# EAGLE design try1 (EAGLE 6.4)
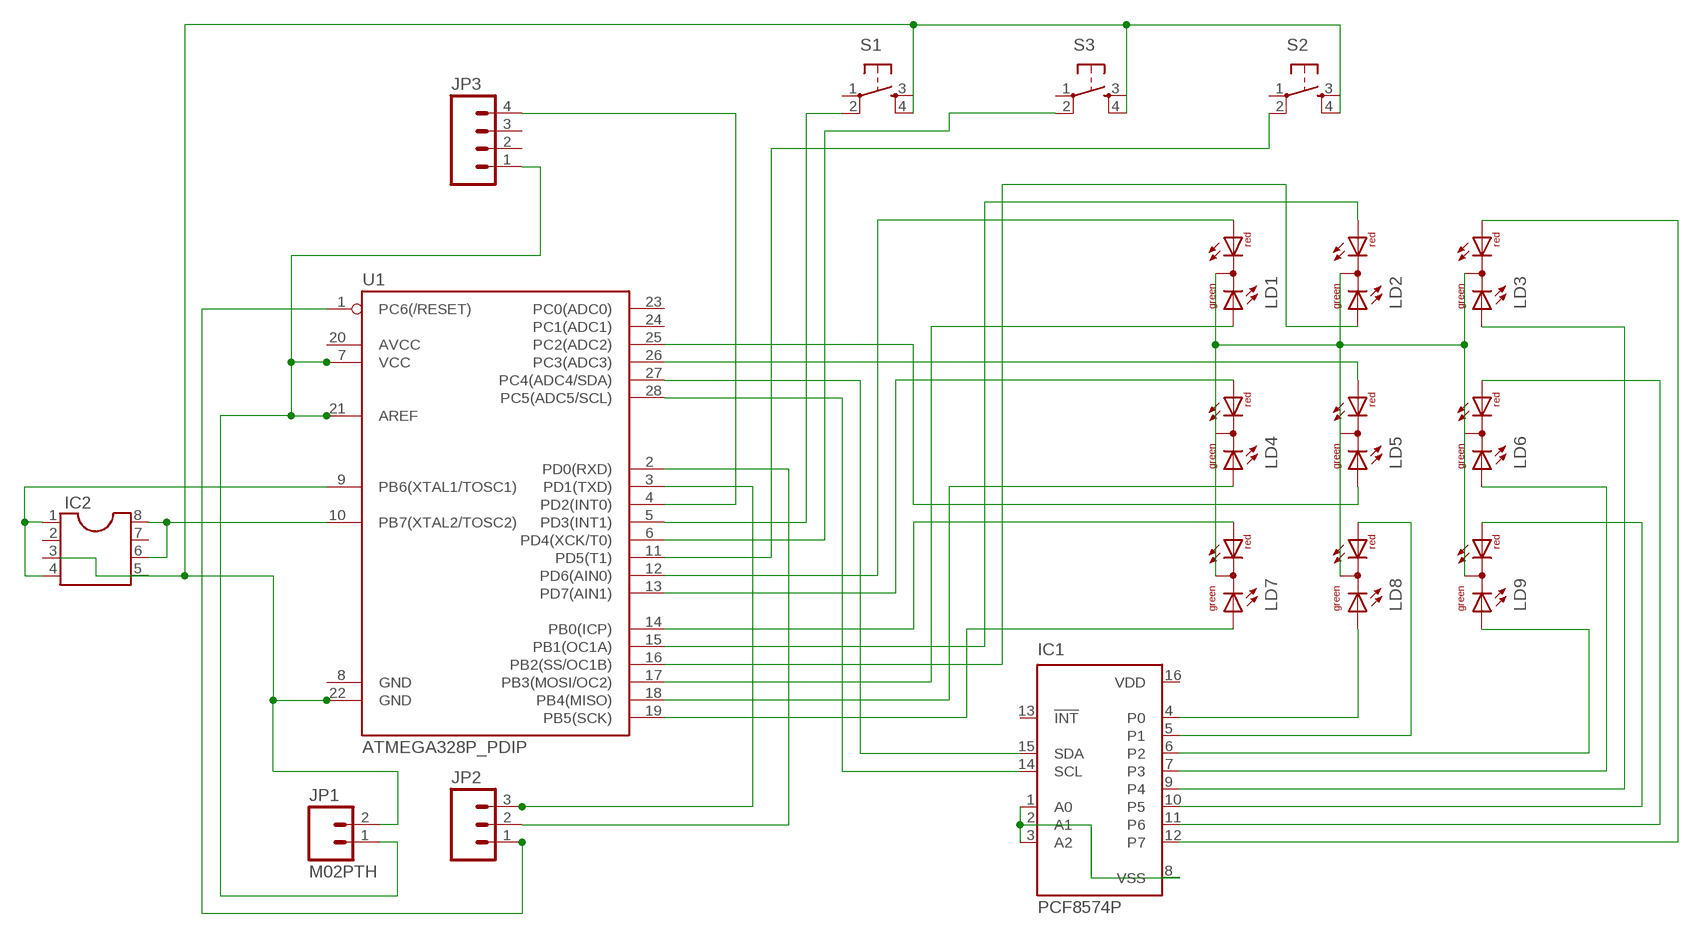
[diagram p0: schematic, sheet 1]

## Parts
IC1  PCF8574P  [DIL16]
IC2  DIL8S  [SOCKET-08]
JP1  M02PTH  [1X02]
JP2  M03PTH  [1X03]
JP3  M04PTH  [1X04]
LD1  DUOLED-RG-C  [DUOLED-C-5MM]
LD2  DUOLED-RG-C  [DUOLED-C-5MM]
LD3  DUOLED-RG-C  [DUOLED-C-5MM]
LD4  DUOLED-RG-C  [DUOLED-C-5MM]
LD5  DUOLED-RG-C  [DUOLED-C-5MM]
LD6  DUOLED-RG-C  [DUOLED-C-5MM]
LD7  DUOLED-RG-C  [DUOLED-C-5MM]
LD8  DUOLED-RG-C  [DUOLED-C-5MM]
LD9  DUOLED-RG-C  [DUOLED-C-5MM]
S1  TAC_SWITCHPTH  [TACTILE-PTH]
S2  TAC_SWITCHPTH  [TACTILE-PTH]
S3  TAC_SWITCHPTH  [TACTILE-PTH]
U1  ATMEGA328P_PDIP  [DIL28-3]

## Nets
GND: JP1.2 S1.4 S2.4 S3.4 U1.22(GND)
N$1: IC2.1 IC2.4 U1.9(PB6(XTAL1/TOSC1))
N$2: JP2.1 U1.1(PC6(/RESET))
N$3: LD1.AR U1.12(PD6(AIN0))
N$4: JP2.3 U1.3(PD1(TXD))
N$5: JP2.2 U1.2(PD0(RXD))
N$6: LD4.AR U1.13(PD7(AIN1))
N$7: IC1.1(A0) IC1.2(A1) IC1.3(A2) IC1.8(VSS)
N$8: IC1.15(SDA) U1.27(PC4(ADC4/SDA))
N$9: IC1.14(SCL) U1.28(PC5(ADC5/SCL))
N$10: S1.2 U1.5(PD3(INT1))
N$11: JP3.4 U1.4(PD2(INT0))
N$12: IC2.6 IC2.8 U1.10(PB7(XTAL2/TOSC2))
N$13: S3.2 U1.6(PD4(XCK/T0))
N$14: S2.2 U1.11(PD5(T1))
N$15: LD7.AR U1.14(PB0(ICP))
N$16: LD1.AX(AG) U1.17(PB3(MOSI/OC2))
N$17: LD4.AX(AG) U1.18(PB4(MISO))
N$18: LD7.AX(AG) U1.19(PB5(SCK))
N$19: LD2.AR U1.15(PB1(OC1A))
N$20: LD2.AX(AG) U1.16(PB2(SS/OC1B))
N$21: IC1.12(P7) LD3.AR
N$22: IC1.11(P6) LD6.AR
N$23: IC1.10(P5) LD9.AR
N$24: IC1.9(P4) LD3.AX(AG)
N$25: IC1.7(P3) LD6.AX(AG)
N$26: IC1.6(P2) LD9.AX(AG)
N$27: IC1.4(P0) LD8.AX(AG)
N$28: IC1.5(P1) LD8.AR
N$29: LD5.AR U1.26(PC3(ADC3))
N$30: LD5.AX(AG) U1.25(PC2(ADC2))
VCC: JP1.1 JP3.1 LD1.C LD2.C LD3.C LD7.C LD8.C LD9.C U1.7(VCC) U1.21(AREF)
Unconnected: IC1.13(!INT) IC2.2 IC2.3 IC2.5 IC2.7 JP3.2 JP3.3 LD4.C LD5.C LD6.C S1.1 S1.3 S2.1 S2.3 S3.1 S3.3 U1.8(GND) U1.20(AVCC) U1.23(PC0(ADC0)) U1.24(PC1(ADC1))

## Power pins joined to a net without a drawn wire
VDD: IC1.16(VDD)

## Library data of the parts
IC1 = micro-philips:PCF8574: I2C-Bus Remote 8-bit I/O expander http://www.semiconductors.philips.com/acrobat_download/datasheets/PCF8574_4.pdf; MPN: PCF8574PN; OC_FARNELL: 204020; OC_NEWARK: 11N8515
IC2 = ic-package:DIL8: Dual In Line / Socket
JP1 = SparkFun-Connectors:M02: Standard 2-pin 0.1" header. Use with - straight break away headers ( PRT-00116) - right angle break away headers (PRT-00553) - swiss pins (PRT-00743) - machine pins (PRT-00117) - female headers (PRT-00115) Molex polarized connector foot print use with: PRT-08233 with associated crimp pins and housings. 2.54_SCREWTERM for use with PRT-10571. 3.5mm Screw Terminal footprints for PRT-08084 5mm Screw Terminal footprints for use with PRT-08433
JP2 = SparkFun-Connectors:M03: Header 3 Standard 3-pin 0.1" header. Use with straight break away headers (SKU : PRT-00116), right angle break away headers (PRT-00553), swiss pins (PRT-00743), machine pins (PRT-00117), and female headers (PRT-00115). Molex polarized connector foot print use with SKU : PRT-08232 with associated crimp pins and housings.
JP3 = SparkFun-Connectors:M04: Header 4 Standard 4-pin 0.1" header. Use with straight break away headers (SKU : PRT-00116), right angle break away headers (PRT-00553), swiss pins (PRT-00743), machine pins (PRT-00117), and female headers (PRT-00115). Molex polarized connector foot print use with SKU : PRT-08231 with associated crimp pins and housings. 1MM SMD Version SKU: PRT-10208
LD1-LD9 = led:DUOLED-RG-C: DUO LED 2 colors (red/green), 5 mm, round, common Cathode www.ligitek.com or other producers.
S1-S3 = SparkFun-Electromechanical:TAC_SWITCH: Momentary Switch Button commonly used for reset or general input. Spark Fun Electronics SKU : COM-00097 SMT- SWCH-08247
U1 = SparkFun-DigitalIC:ATMEGA328P_PDIP: uC used in the Arduino 32kb flash, 1k EEPROM, 2k SRAM This is the through-hole version of this chip.

## Board
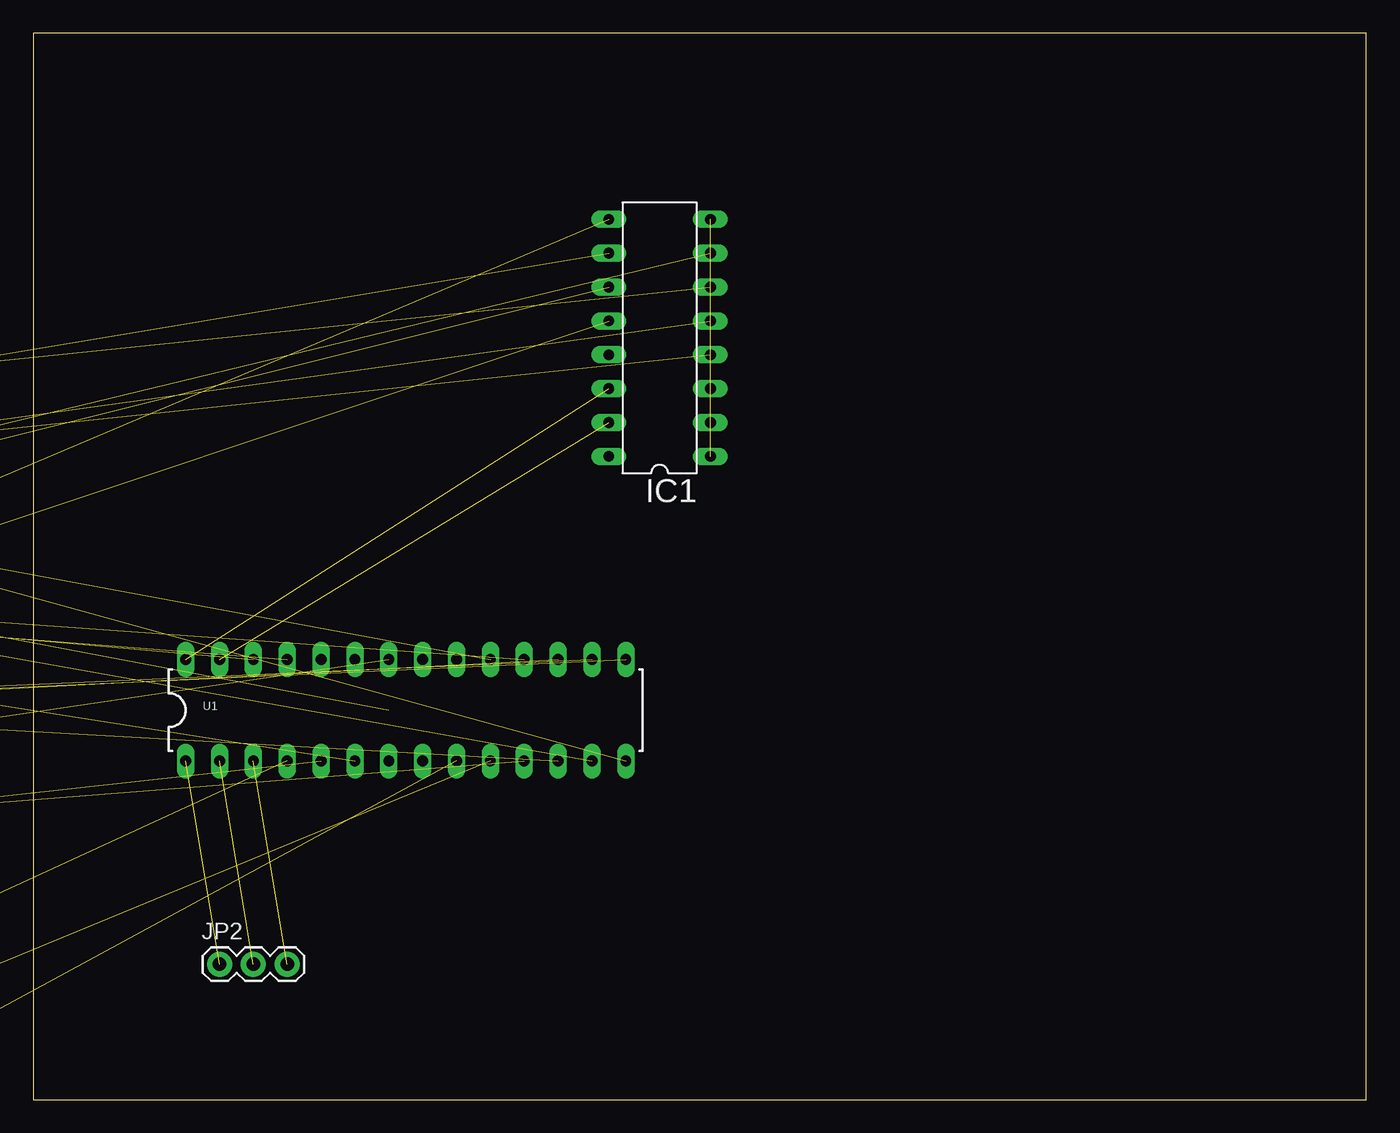
[diagram p1: board, top side]
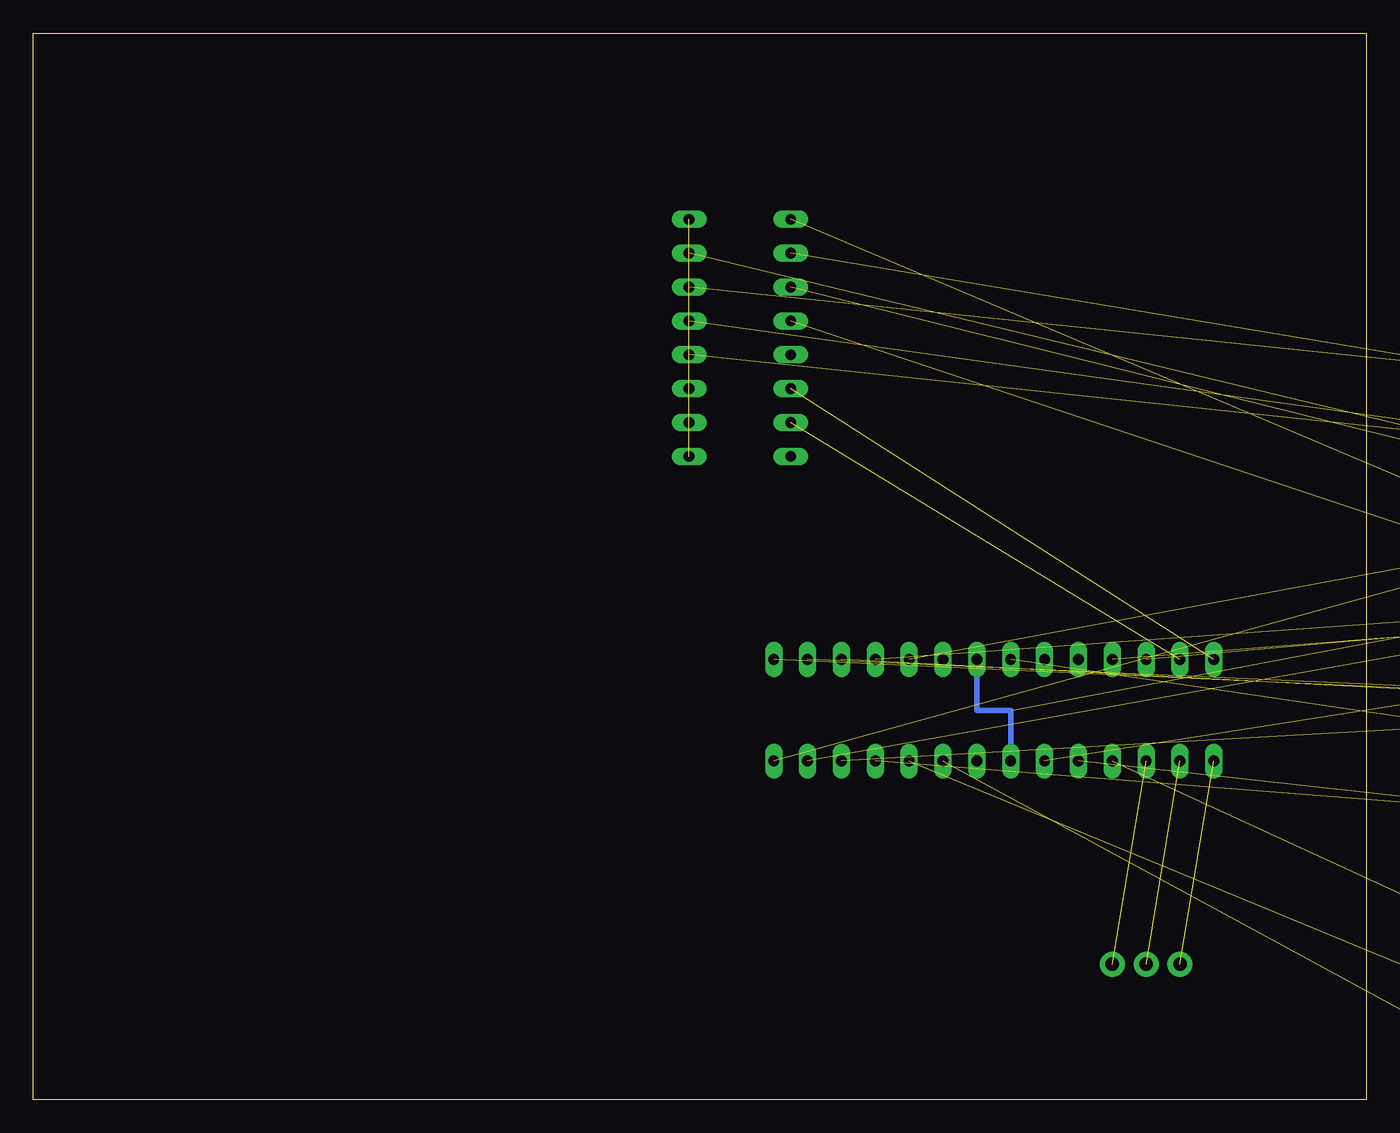
[diagram p2: board, bottom side, seen from below]

Size 100 x 80 mm. Coordinates in mm from the lower left corner, seen from the top.
Outline: 0,0 100,0 100,80 0,80 0,0
Copper layers (1*16): Top 0.035mm / dielectric 1.5mm / Bottom 0.035mm
Design rules "default": minimum track width 10mil, minimum drill 24mil, track to track 8mil, track to pad 8mil, pad to pad 8mil, via to via 8mil, smd to smd 8mil, copper to edge 40mil, drill to drill 8mil, minimum pad ring 10mil, minimum via ring 8mil, stop-mask expansion 4mil, vias tented up to drill 0mil, thermal gap 10mil

### Footprints (pad centres in the part's own frame; a part is rotated, then mirrored left to right if it is on the bottom)
DIL16 = drill 0.813 long: 1 -8.89,-3.81; 2 -6.35,-3.81; 3 -3.81,-3.81; 4 -1.27,-3.81; 5 1.27,-3.81; 6 3.81,-3.81; 7 6.35,-3.81; 8 8.89,-3.81; 9 8.89,3.81; 10 6.35,3.81; 11 3.81,3.81; 12 1.27,3.81; 13 -1.27,3.81; 14 -3.81,3.81; 15 -6.35,3.81; 16 -8.89,3.81
SOCKET-08 = drill 0.813 long: 1 -3.81,-3.81; 2 -1.27,-3.81; 3 1.27,-3.81; 4 3.81,-3.81; 5 3.81,3.81; 6 1.27,3.81; 7 -1.27,3.81; 8 -3.81,3.81
1X02 = drill 1.016 pad 1.88: 1 0,0; 2 2.54,0
1X03 = drill 1.016 pad 1.88: 1 0,0; 2 2.54,0; 3 5.08,0
1X04 = drill 1.016 pad 1.88 square: 1 0,0 | drill 1.016 pad 1.88: 2 2.54,0; 3 5.08,0; 4 7.62,0
DUOLED-C-5MM = drill 0.813 long: AR 2.54,0; AX -2.54,0; C 0,0
TACTILE-PTH = drill 1.016 pad 1.88: 1 -3.251,2.261; 2 3.251,2.261; 3 -3.251,-2.261; 4 3.251,-2.261
DIL28-3 = drill 0.813 long: 1 -16.51,-3.81; 2 -13.97,-3.81; 3 -11.43,-3.81; 4 -8.89,-3.81; 5 -6.35,-3.81; 6 -3.81,-3.81; 7 -1.27,-3.81; 8 1.27,-3.81; 9 3.81,-3.81; 10 6.35,-3.81; 11 8.89,-3.81; 12 11.43,-3.81; 13 13.97,-3.81; 14 16.51,-3.81; 15 16.51,3.81; 16 13.97,3.81; 17 11.43,3.81; 18 8.89,3.81; 19 6.35,3.81; 20 3.81,3.81; 21 1.27,3.81; 22 -1.27,3.81; 23 -3.81,3.81; 24 -6.35,3.81; 25 -8.89,3.81; 26 -11.43,3.81; 27 -13.97,3.81; 28 -16.51,3.81

### Placement (x,y rotation side)
IC1  46.99,57.15 90 top
IC2  -46.99,-11.43 0 top  (outside the outline)
JP1  -30.48,54.61 0 top  (outside the outline)
JP2  13.97,10.16 0 top
JP3  -52.07,-3.81 0 top  (outside the outline)
LD1  -30.48,29.21 0 top  (outside the outline)
LD2  -41.91,29.21 0 top  (outside the outline)
LD3  -20.32,38.1 0 top  (outside the outline)
LD4  -31.75,38.1 0 top  (outside the outline)
LD5  -43.18,38.1 0 top  (outside the outline)
LD6  -20.32,45.72 0 top  (outside the outline)
LD7  -31.75,45.72 0 top  (outside the outline)
LD8  -43.18,45.72 0 top  (outside the outline)
LD9  -20.32,53.34 0 top  (outside the outline)
S1  -41.91,16.51 0 top  (outside the outline)
S2  -50.8,16.51 0 top  (outside the outline)
S3  -17.78,29.21 0 top  (outside the outline)
U1  27.94,29.21 0 top

### Tracks (layer width: path | path; a pad name or v marks a point on that pad's centre or on a via)
GND  (4 unrouted)
N$1  (2 unrouted)
N$2  (1 unrouted)
N$3  (1 unrouted)
N$4  (1 unrouted)
N$5  (1 unrouted)
N$6  (1 unrouted)
N$7  (3 unrouted)
N$8  (1 unrouted)
N$9  (1 unrouted)
N$10  (1 unrouted)
N$11  (1 unrouted)
N$12  (2 unrouted)
N$13  (1 unrouted)
N$14  (1 unrouted)
N$15  (1 unrouted)
N$16  (1 unrouted)
N$17  (1 unrouted)
N$18  (1 unrouted)
N$19  (1 unrouted)
N$20  (1 unrouted)
N$21  (1 unrouted)
N$22  (1 unrouted)
N$23  (1 unrouted)
N$24  (1 unrouted)
N$25  (1 unrouted)
N$26  (1 unrouted)
N$27  (1 unrouted)
N$28  (1 unrouted)
N$29  (1 unrouted)
N$30  (1 unrouted)
VCC  (8 unrouted)
  Bottom 0.406: U1.7 26.67,29.21 29.21,29.21 U1.21